# EAGLE design cali (EAGLE 9.6.2)

## Sheet 1 of 2
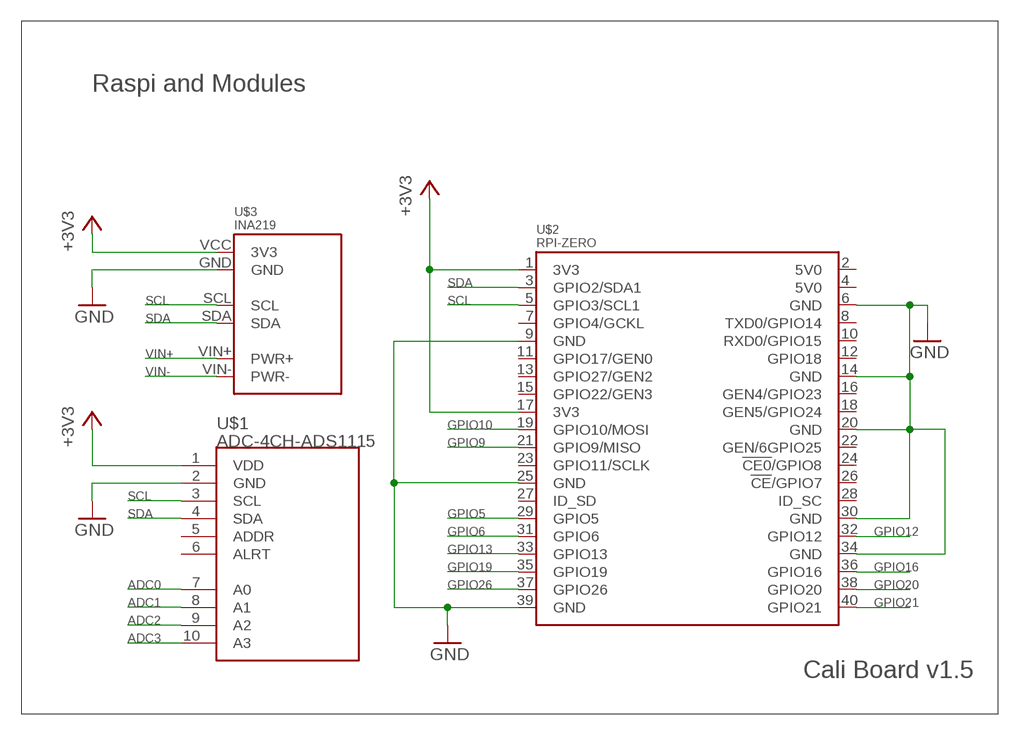
[diagram p0: schematic, sheet 1]

### Parts
U$1  ADC-4CH-ADS1115  [ADC-4CH-ADS1115]
U$2  RPI-ZERO  [RASP_PI_ZERO_BOARD_FULL]
U$3  INA219  [INA219]

### Nets
+3V3: U$1.1(VDD) U$2.1(3V3) U$2.17(3V3) U$3.VCC(3V3) ; also sheet 2
ADC0: U$1.7(A0) ; also sheet 2
ADC1: U$1.8(A1) ; also sheet 2
ADC2: U$1.9(A2) ; also sheet 2
ADC3: U$1.10(A3) ; also sheet 2
GND: U$1.2(GND) U$2.6(GND) U$2.9(GND) U$2.14(GND) U$2.20(GND) U$2.25(GND) U$2.30(GND) U$2.34(GND) U$2.39(GND) U$3.GND ; also sheet 2
GPIO5: U$2.29(GPIO5) ; also sheet 2
GPIO6: U$2.31(GPIO6) ; also sheet 2
GPIO9: U$2.21(GPIO9/MISO) ; also sheet 2
GPIO10: U$2.19(GPIO10/MOSI)
GPIO12: U$2.32(GPIO12)
GPIO13: U$2.33(GPIO13) ; also sheet 2
GPIO16: U$2.36(GPIO16)
GPIO19: U$2.35(GPIO19) ; also sheet 2
GPIO20: U$2.38(GPIO20)
GPIO21: U$2.40(GPIO21)
GPIO26: U$2.37(GPIO26) ; also sheet 2
SCL: U$1.3(SCL) U$2.5(GPIO3/SCL1) U$3.SCL
SDA: U$1.4(SDA) U$2.3(GPIO2/SDA1) U$3.SDA
VIN+: U$3.VIN+(PWR+)
VIN-: U$3.VIN-(PWR-)
Unconnected: U$1.5(ADDR) U$1.6(ALRT) U$2.2(5V0) U$2.4(5V0) U$2.7(GPIO4/GCKL) U$2.8(TXD0/GPIO14) U$2.10(RXD0/GPIO15) U$2.11(GPIO17/GEN0) U$2.12(GPIO18) U$2.13(GPIO27/GEN2) U$2.15(GPIO22/GEN3) U$2.16(GEN4/GPIO23) U$2.18(GEN5/GPIO24) U$2.22(GEN/6GPIO25) U$2.23(GPIO11/SCLK) U$2.24(!CE0!/GPIO8) U$2.26(!CE!/GPIO7) U$2.27(ID_SD) U$2.28(ID_SC)

### Notes on the sheet
- Raspi and Modules
- Cali Board v1.5

## Sheet 2 of 2
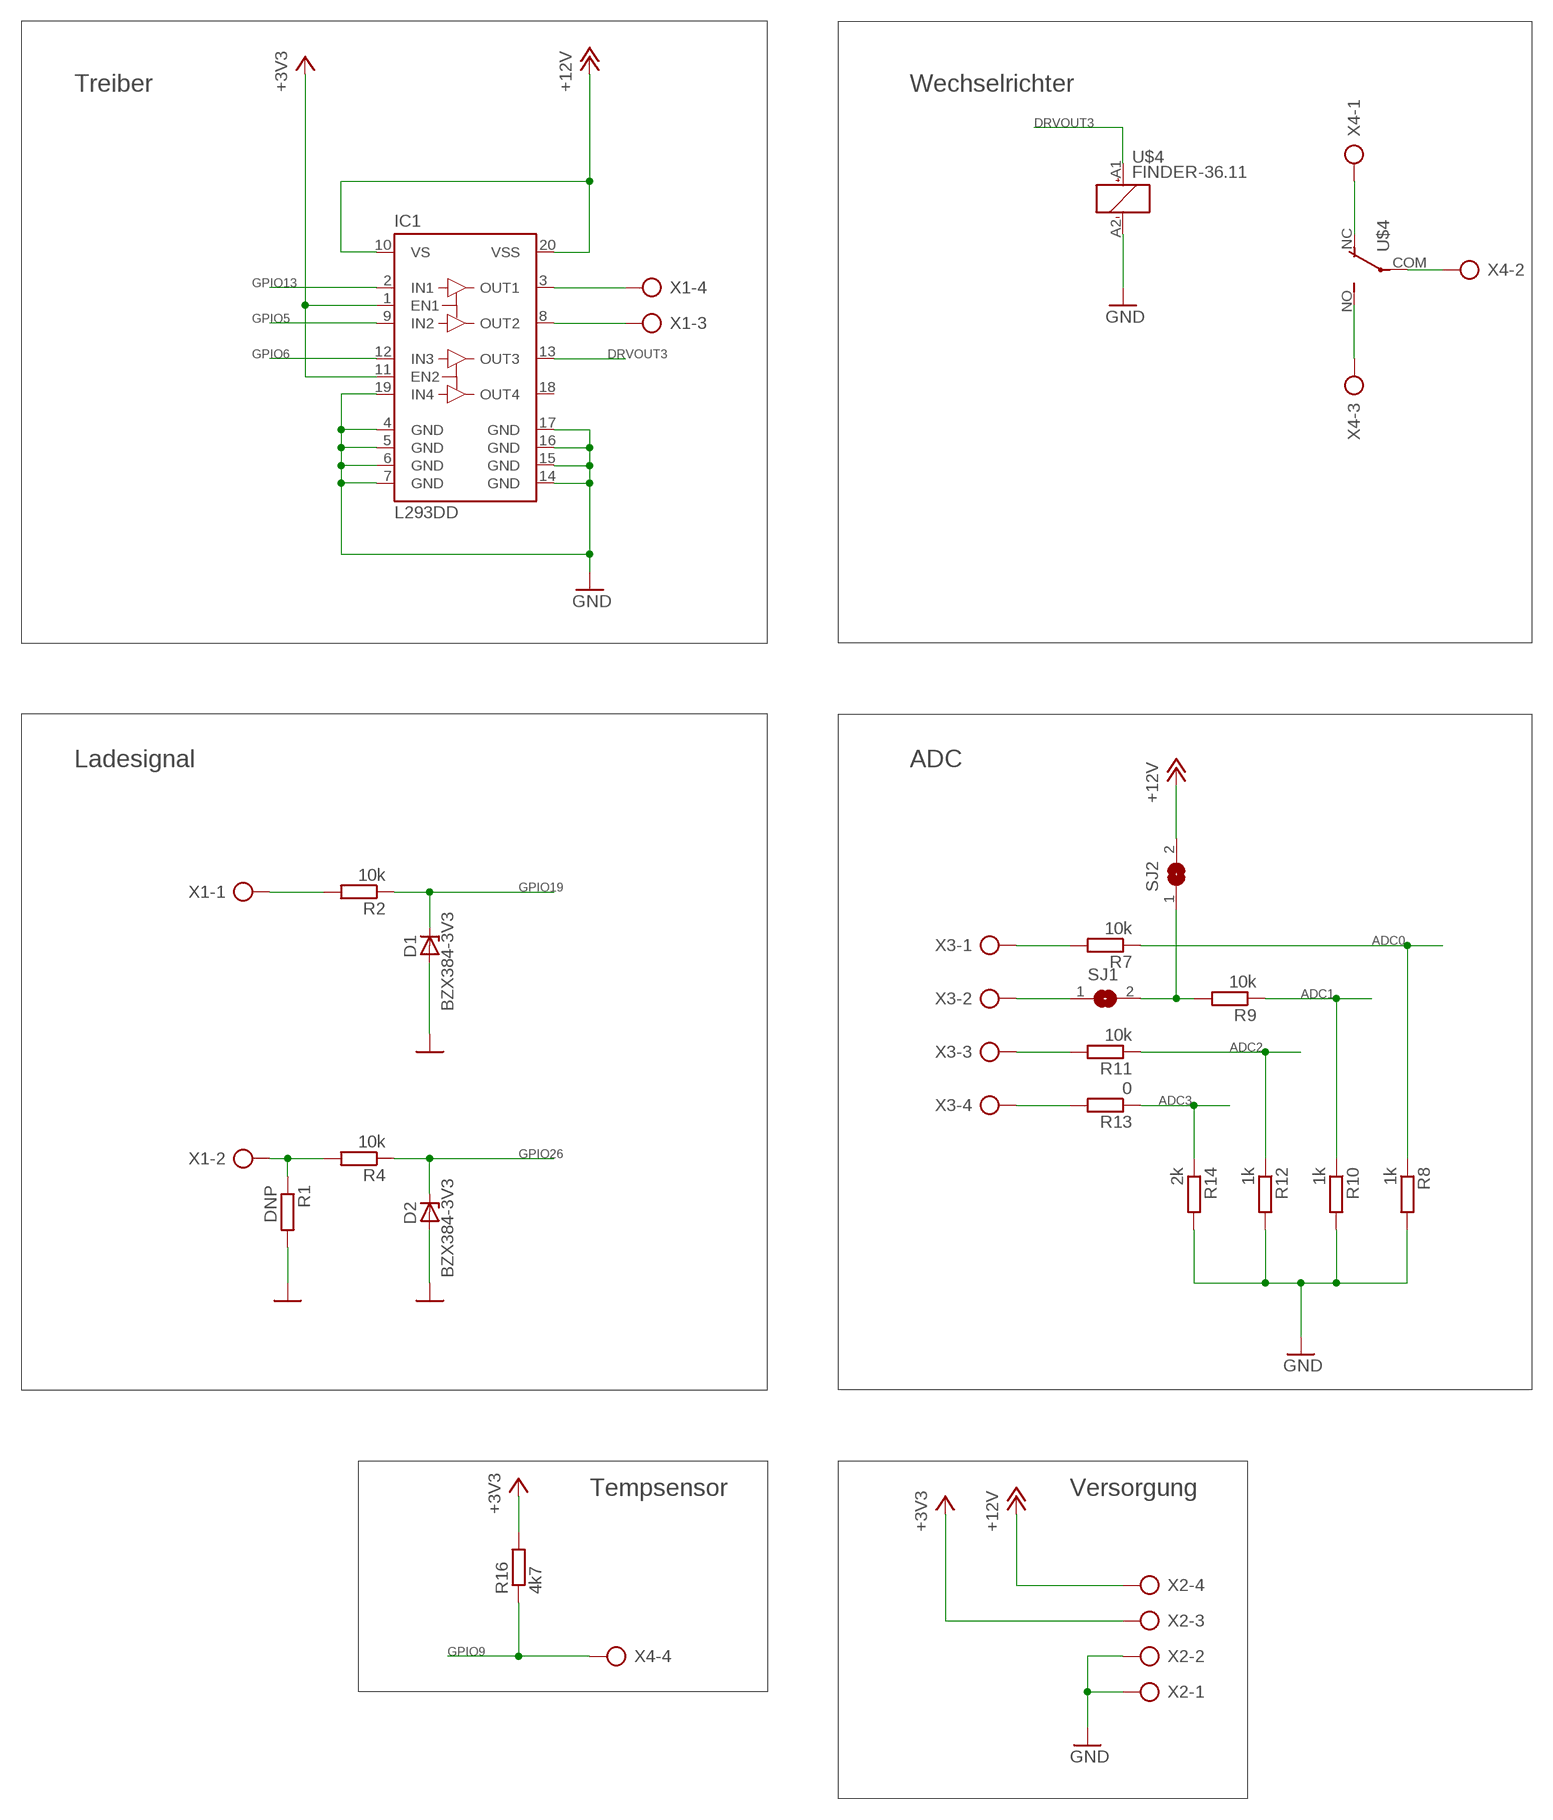
[diagram p1: schematic, sheet 2]

### Parts
D1  BZX384-3V3  BZX84J  [SOD323(F)]
D2  BZX384-3V3  BZX84J  [SOD323(F)]
IC1  L293DD  [SO20]
R1  DNP  R-EU_R1206  [R1206]
R2  10k  R-EU_R1206  [R1206]
R4  10k  R-EU_R1206  [R1206]
R7  10k  R-EU_R1206  [R1206]
R8  1k  R-EU_R1206  [R1206]
R9  10k  R-EU_R1206  [R1206]
R10  1k  R-EU_R1206  [R1206]
R11  10k  R-EU_R1206  [R1206]
R12  1k  R-EU_R1206  [R1206]
R13  0  R-EU_R1206  [R1206]
R14  2k  R-EU_R1206  [R1206]
R16  4k7  R-EU_R1206  [R1206]
SJ1  SJ  [SJ]
SJ2  SJ  [SJ]
U$4  FINDER-36.11  [FINDER-36.11]
X1  AK500/4  [AK500/4]
X2  AK500/4  [AK500/4]
X3  AK500/4  [AK500/4]
X4  AK500/4  [AK500/4]

### Nets
+3V3: IC1.1(EN1) IC1.11(EN2) R16.2 X2.3 ; also sheet 1
+12V: IC1.10(VS) IC1.20(VSS) SJ2.2 X2.4
ADC0: R7.1 R8.1 ; also sheet 1
ADC1: R9.1 R10.1 ; also sheet 1
ADC2: R11.1 R12.1 ; also sheet 1
ADC3: R13.1 R14.1 ; also sheet 1
DRVOUT3: IC1.13(OUT3) U$4.A1(+)
GND: D1.2(A) D2.2(A) IC1.4(GND) IC1.5(GND) IC1.6(GND) IC1.7(GND) IC1.14(GND) IC1.15(GND) IC1.16(GND) IC1.17(GND) IC1.19(IN4) R1.2 R8.2 R10.2 R12.2 R14.2 U$4.A2(-) X2.1 X2.2 ; also sheet 1
GPIO5: IC1.9(IN2) ; also sheet 1
GPIO6: IC1.12(IN3) ; also sheet 1
GPIO9: R16.1 X4.4 ; also sheet 1
GPIO13: IC1.2(IN1) ; also sheet 1
GPIO19: D1.1(C) R2.1 ; also sheet 1
GPIO26: D2.1(C) R4.1 ; also sheet 1
I_SOL: R13.2 X3.4
N$1: R2.2 X1.1
N$2: IC1.3(OUT1) X1.4
N$3: U$4.NO(S) X4.3
N$5: U$4.COM(P) X4.2
N$6: IC1.8(OUT2) X1.3
N$7: U$4.NC(O) X4.1
N$9: R1.1 R4.2 X1.2
N$13: R9.2 SJ1.2 SJ2.1
V_BAT: SJ1.1 X3.2
V_SOL: R7.2 X3.1
V_START: R11.2 X3.3
Unconnected: IC1.18(OUT4)

### Notes on the sheet
- Treiber | Wechselrichter
- Ladesignal | ADC
- Tempsensor | Versorgung

## Library data of the parts
D1 D2 = nxp_60:BZX84J
IC1 = st-microelectronics:L293DD: PUSH-PULL FOUR CHANNEL DRIVER WITH DIODES Source: http://www.st.com/stonline/books/pdf/docs/1330.pdf; OC_FARNELL: unknown
R1 R2 R4 R7-R14 R16 = rcl:R-EU_: RESISTOR, European symbol; SPICEPREFIX: R
SJ1 SJ2 = jumper:SJ: SMD solder JUMPER
U$1 = diy-modules:ADC-4CH-ADS1115: 4 Channel 16-Bit Analog-to-Digital Converter based on ADS1115 chip Arduino ADS1115 Getting Started Tutorial is available here: http://henrysbench.capnfatz.com/henrys-bench/arduino-voltage-measurements/arduino-ads1115-module-getting-started-tutorial/ ADS1115 datasheet is available here: http://www.ti.com/lit/ds/symlink/ads1115.pdf Click here to find device on ebay.com <http://www.ebay.com/sch/ads1115+module>
U$2 = rpi-zero:RPI-ZERO
U$3 = rpi-zero:INA219
U$4 = relay2:FINDER-36.11
X1-X4 = con-ptr500:AK500/4: CONNECTOR; OC_FARNELL: unknown; OC_NEWARK: unknown

## Board
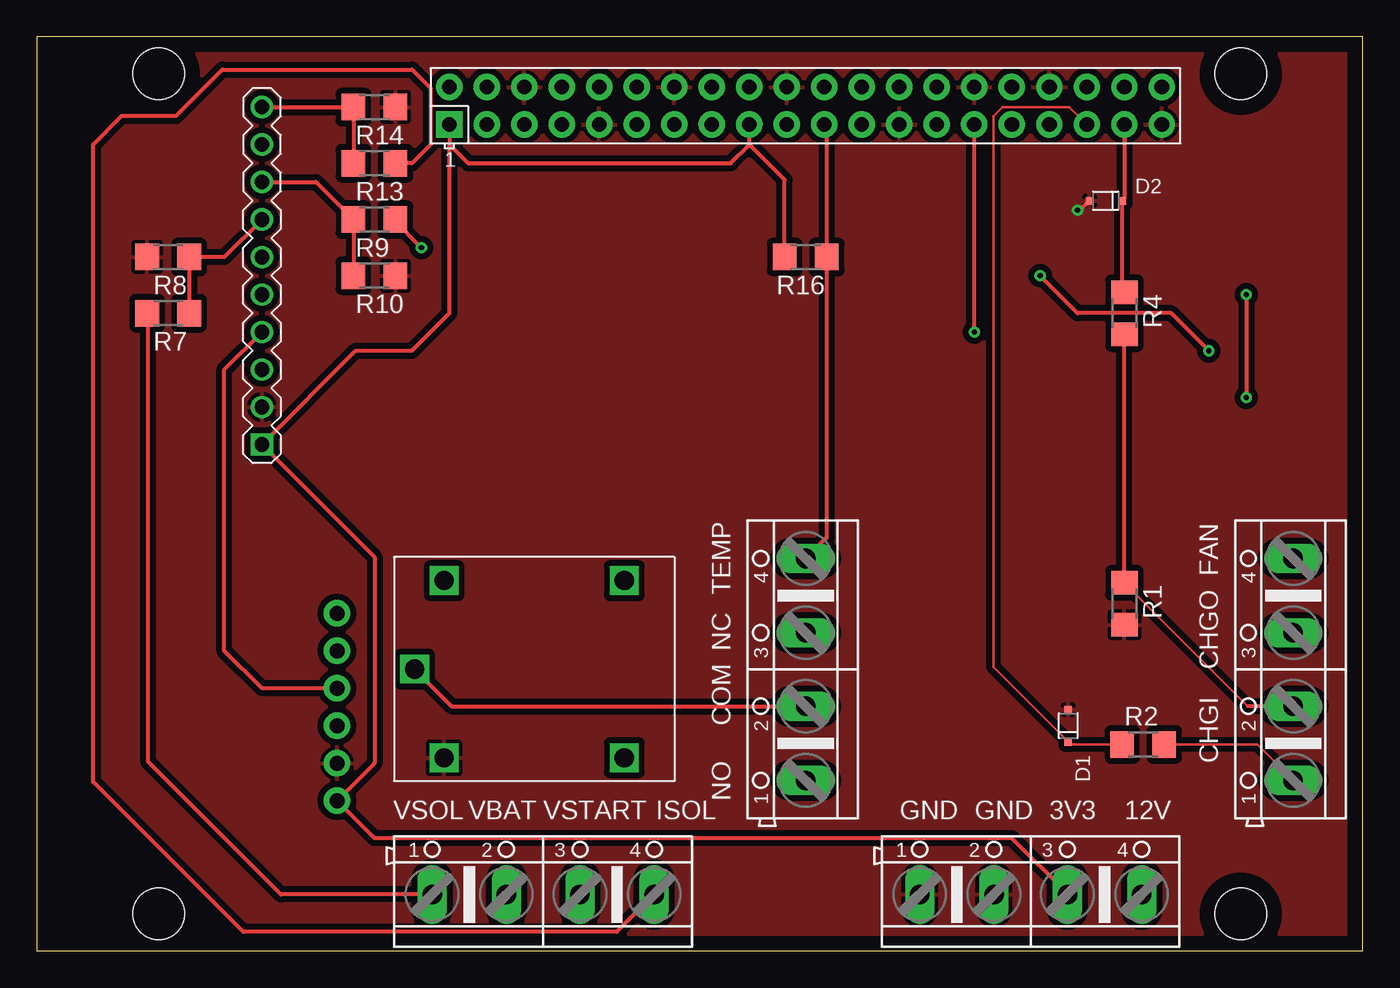
[diagram p2: board, top side]
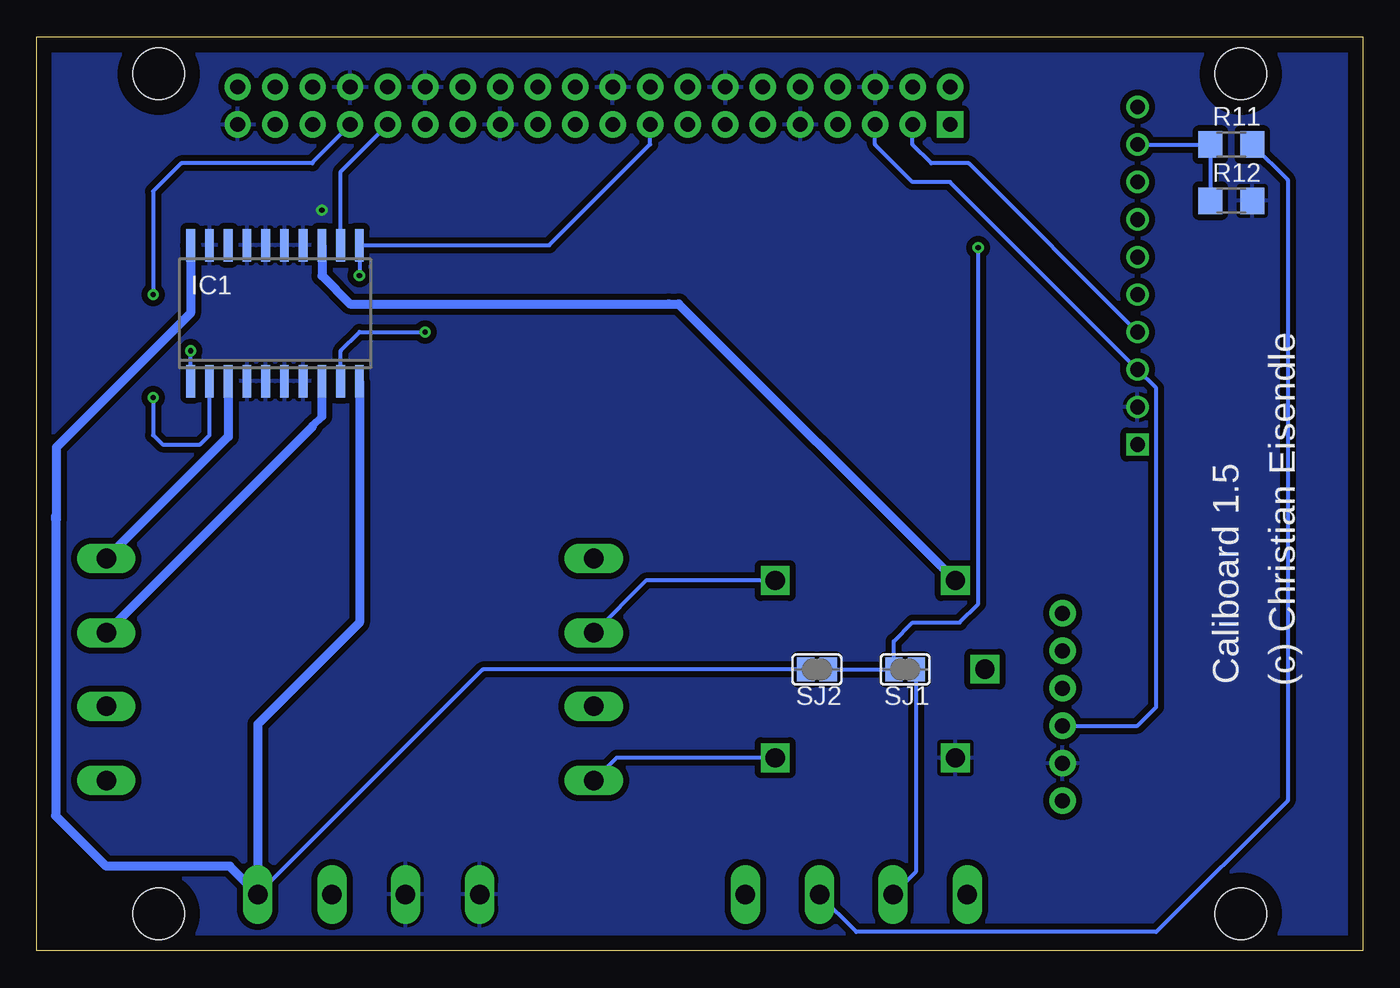
[diagram p3: board, bottom side, seen from below]

Size 89.79 x 61.9 mm. Coordinates in mm from the lower left corner, seen from the top.
Outline: 0,0 89.79,0 89.79,61.9 0,61.9 0,0
Copper layers (1*16): Top 0.035mm / dielectric 1.5mm / Bottom 0.035mm
Design rules "default": minimum track width 6mil, minimum drill 0.35mm, track to track 6mil, track to pad 6mil, pad to pad 6mil, via to via 6mil, smd to smd 6mil, copper to edge 40mil, drill to drill 6mil, minimum pad ring 10mil, minimum via ring 8mil, stop-mask expansion 4mil, vias tented up to drill 0mil, thermal gap 10mil
Holes 3.5 mm at 8.24,59.4 81.55,59.4 8.24,2.5 81.55,2.5

### Footprints (pad centres in the part's own frame; a part is rotated, then mirrored left to right if it is on the bottom)
SOD323(F) = smd 0.5 x 0.5: 1 1.1,0; 2 -1.1,0
SO20 = smd 0.6 x 2.2: 1 -5.715,-4.6; 2 -4.445,-4.6; 3 -3.175,-4.6; 4 -1.905,-4.6; 5 -0.635,-4.6; 6 0.635,-4.6; 7 1.905,-4.6; 8 3.175,-4.6; 9 4.445,-4.6; 10 5.715,-4.6; 11 5.715,4.6; 12 4.445,4.6; 13 3.175,4.6; 14 1.905,4.6; 15 0.635,4.6; 16 -0.635,4.6; 17 -1.905,4.6; 18 -3.175,4.6; 19 -4.445,4.6; 20 -5.715,4.6
R1206 = smd 1.6 x 1.803: 1 -1.422,0; 2 1.422,0
SJ = smd 1.168 x 1.6: 1 -0.762,0; 2 0.762,0
ADC-4CH-ADS1115 = drill 1 square: 1 -6.35,11.43 | drill 1: 2 -6.35,8.89; 3 -6.35,6.35; 4 -6.35,3.81; 5 -6.35,1.27; 6 -6.35,-1.27; 7 -6.35,-3.81; 8 -6.35,-6.35; 9 -6.35,-8.89; 10 -6.35,-11.43
RASP_PI_ZERO_BOARD_FULL = drill 1 pad 1.778 square: 1 8.37,25.23 | drill 1 pad 1.778: 2 8.37,27.77; 3 10.91,25.23; 4 10.91,27.77; 5 13.45,25.23; 6 13.45,27.77; 7 15.99,25.23; 8 15.99,27.77; 9 18.53,25.23; 10 18.53,27.77; 11 21.07,25.23; 12 21.07,27.77; 13 23.61,25.23; 14 23.61,27.77; 15 26.15,25.23; 16 26.15,27.77; 17 28.69,25.23; 18 28.69,27.77; 19 31.23,25.23; 20 31.23,27.77; 21 33.77,25.23; 22 33.77,27.77; 23 36.31,25.23; 24 36.31,27.77; 25 38.85,25.23; 26 38.85,27.77; 27 41.39,25.23; 28 41.39,27.77; 29 43.93,25.23; 30 43.93,27.77; 31 46.47,25.23; 32 46.47,27.77; 33 49.01,25.23; 34 49.01,27.77; 35 51.55,25.23; 36 51.55,27.77; 37 54.09,25.23; 38 54.09,27.77; 39 56.63,25.23; 40 56.63,27.77
INA219 = drill 1.016 pad 1.778: GND 9.271,2.794; SCL 11.811,2.794; SDA 14.351,2.794; VCC 6.731,2.794; VIN+ 19.431,2.794; VIN- 16.891,2.794
FINDER-36.11 = drill 1.3 square: A1 15.6,1.6; A2 15.6,13.6; COM 17.6,7.6; NC 3.4,13.6; NO 3.4,1.6
AK500/4 = drill 1.321 long: 1 -7.518,0; 2 -2.489,0; 3 2.489,0; 4 7.518,0

### Placement (x,y rotation side)
D1  69.85,15.24 270 top
D2  72.39,50.8 0 top
IC1  73.66,43.18 0 bottom
R1  73.66,23.5 270 top
R2  74.93,13.97 0 top
R4  73.66,43.18 270 top
R7  8.89,43.18 180 top
R8  8.89,46.99 180 top
R9  22.86,49.53 0 top
R10  22.86,45.72 0 top
R11  8.89,54.61 0 bottom
R12  8.89,50.8 0 bottom
R13  22.86,53.34 0 top
R14  22.86,57.15 0 top
R16  52.07,46.99 180 top
SJ1  30.99,19.05 180 bottom
SJ2  36.96,19.05 180 bottom
U$1  8.89,45.72 180 top
U$2  19.56,30.73 0 top
U$3  23.11,3.43 90 top
U$4  43.18,26.67 180 top
X1  85.09,19.05 90 top
X2  67.31,3.81 0 top
X3  34.29,3.81 0 top
X4  52.07,19.05 90 top

### Tracks (layer width: path | path; a pad name or v marks a point on that pad's centre or on a via)
+3V3  (via drill 0.35)
  Top 0.254: U$2.1 27.94,54.61 | 27.94,54.61 29.21,53.34 46.99,53.34 48.26,54.61 | 48.26,54.61 U$2.17 | 27.94,54.61 27.94,43.18 25.4,40.64 21.59,40.64 U$1.1 22.86,26.67 22.86,12.7 U$3.VCC 22.86,7.62 66.04,7.62 69.85,3.81 X2.3 | R16.2 50.65,52.22 48.26,54.61 | v79.38,40.64 76.83,43.18 70.48,43.18 v67.94,45.72
  Bottom 0.254: U$2.17 48.25,54.62 55.09,47.78 IC1.11 v67.94,45.72 | IC1.1 v79.38,40.64
+12V
  Bottom 0.254: SJ2.2 59.59,19.05 X2.4
  Bottom 0.61: 88.52,29.43 88.52,29.21 | 88.52,29.21 88.52,9.14 85.09,5.71 76.73,5.71 X2.4 74.83,15.34 67.94,22.23 IC1.10 | IC1.20 79.38,43.18 88.47,34.09 88.47,29.26 | 88.47,29.21 88.47,29.26 | 88.52,29.21 88.47,29.26
ADC0
  Top 0.254: U$1.7 12.7,46.99 R8.1 R7.1
ADC1
  Top 0.254: U$1.8 18.9,52.07 R9.1 R10.1
ADC2
  Bottom 0.254: U$1.9 R11.1 R12.1
ADC3
  Top 0.254: U$1.10 R14.1 R13.1
DRVOUT3
  Bottom 0.61: IC1.13 70.48,45.72 68.58,43.81 46.99,43.81 46.33,43.81 U$4.A1
GND  (via drill 0.35)
  Top 0.254: D2.2 70.66,50.16 v70.48,50.16
  pour Top (isolate 0.406): 0,0 0,60.96 88.9,60.96 88.9,0
  pour Bottom (isolate 0.406): 0,0 0,60.96 90.17,60.96 90.17,0
GPIO5  (via drill 0.35)
  Top 0.254: v63.5,41.91 U$2.29
  Bottom 0.254: IC1.9 69.22,40.64 67.94,41.91 v63.5,41.91
GPIO6
  Bottom 0.254: U$2.31 69.22,52.78 IC1.12
GPIO9
  Top 0.254: 52.07,26.67 X4.4 53.49,27.99 R16.1 53.49,55.8 U$2.21
GPIO13  (via drill 0.35)
  Top 0.254: v81.92,44.45 v81.92,37.47
  Bottom 0.254: v81.92,37.47 81.92,34.92 81.28,34.29 78.74,34.29 78.11,34.92 IC1.2 | U$2.33 71.12,53.41 71.12,53.34 80.01,53.34 81.92,51.44 v81.92,44.45
GPIO19
  Top 0.152: R2.1 70.02,13.97 69.94,14.05 D1.1 64.77,19.22 64.77,56.52 65.41,57.15 69.92,57.15 U$2.35
GPIO26
  Top 0.254: 73.66,50.63 D2.1 | U$2.37 73.65,50.96 D2.1 | D2.1 73.49,44.77 R4.1
I_SOL
  Top 0.254: X3.4 39.27,1.27 13.97,1.27 3.81,11.43 3.81,54.61 5.76,56.56 9.42,56.56 12.55,59.69 25.4,59.69 26.67,58.42 26.67,54.61 25.4,53.34 R13.2 24.13,53.34
N$1
  Top 0.152: R2.2 82.65,13.97 X1.1
N$2
  Bottom 0.61: IC1.3 76.83,34.82 X1.4
N$3
  Bottom 0.254: U$4.NO 48.54,25.07 X4.3
N$5
  Top 0.254: U$4.COM 28.09,16.56 X4.2
N$6
  Bottom 0.508: 71.12,35.51 71.12,35.56 70.48,36.2
  Bottom 0.61: X1.3 71.12,35.51 | 70.48,36.2 IC1.8
N$7
  Bottom 0.254: U$4.NC 50.53,13.07 X4.1
N$9
  Top 0.152: 82.02,16.56 R1.1
  Top 0.254: X1.2 82.02,16.56 | R1.1 R4.2
N$13  (via drill 0.35)
  Top 0.254: v26.04,47.62 24.28,49.38 R9.2
  Bottom 0.254: SJ2.1 SJ1.2 31.75,20.95 30.48,22.23 27.3,22.23 26.04,23.5 v26.04,47.62
SCL
  Bottom 0.254: U$3.SCL 15.24,15.24 13.97,16.51 13.97,38.1 U$1.3 27.94,52.07 30.48,52.07 33.02,54.61 U$2.5
SDA
  Top 0.254: U$3.SDA 15.24,17.78 12.7,20.32 12.7,39.37 U$1.4
  Bottom 0.254: U$1.4 26.67,53.34 29.21,53.34 30.48,54.61 U$2.3
V_BAT
  Bottom 0.254: X3.2 30.23,5.38 SJ1.1
V_SOL
  Top 0.254: R7.2 7.54,43.1 | 7.54,43.1 7.62,43.03 | X3.1 16.51,3.81 7.54,12.78 7.54,43.1
V_START
  Top 0.254: 36.78,3.76 X3.3
  Bottom 0.254: R11.2 5.08,52.22 5.08,10.16 13.97,1.27 34.29,1.27 36.78,3.76 X3.3

### Text on the board
tNames: FAN | TEMP | NC | CHGO | COM | CHGI | NO | VSOL | VBAT | VSTART | ISOL | GND | GND | 3V3 | 12V
bNames: (c) Christian Eisendle | Caliboard 1.5